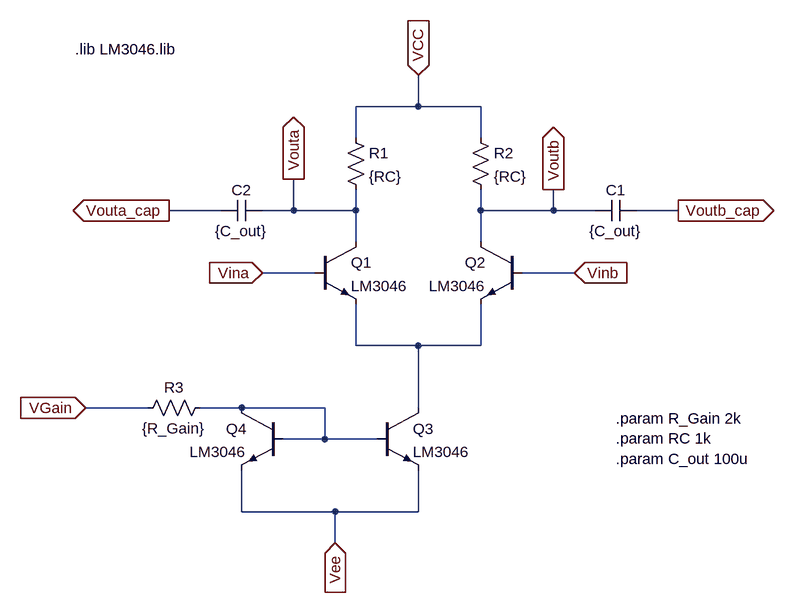
[diagram p0: schematic VariableGainAmplifier.asc]
VariableGainAmplifier.asc, the LTspice schematic file:
Version 4
SHEET 1 880 680
WIRE 192 -352 192 -400
WIRE 192 -352 96 -352
WIRE 288 -352 192 -352
WIRE 96 -304 96 -352
WIRE 288 -304 288 -352
WIRE -112 -192 -192 -192
WIRE 0 -192 0 -240
WIRE 0 -192 -48 -192
WIRE 96 -192 96 -224
WIRE 96 -192 0 -192
WIRE 288 -192 288 -224
WIRE 400 -192 400 -224
WIRE 400 -192 288 -192
WIRE 464 -192 400 -192
WIRE 592 -192 528 -192
WIRE 96 -144 96 -192
WIRE 288 -144 288 -192
WIRE 32 -96 -48 -96
WIRE 432 -96 352 -96
WIRE 96 16 96 -48
WIRE 192 16 96 16
WIRE 288 16 288 -48
WIRE 288 16 192 16
WIRE -224 112 -320 112
WIRE -80 112 -144 112
WIRE 48 112 -80 112
WIRE 192 112 192 16
WIRE 48 160 48 112
WIRE 48 160 -16 160
WIRE 128 160 48 160
WIRE -80 272 -80 208
WIRE 64 272 -80 272
WIRE 192 272 192 208
WIRE 192 272 64 272
WIRE 64 320 64 272
FLAG -48 -96 Vina
IOPIN -48 -96 In
FLAG 432 -96 Vinb
IOPIN 432 -96 In
FLAG 0 -240 Vouta
IOPIN 0 -240 Out
FLAG 400 -224 Voutb
IOPIN 400 -224 Out
FLAG 192 -400 VCC
IOPIN 192 -400 In
FLAG -320 112 VGain
IOPIN -320 112 In
FLAG 64 320 Vee
IOPIN 64 320 In
FLAG 592 -192 Voutb_cap
IOPIN 592 -192 Out
FLAG -192 -192 Vouta_cap
IOPIN -192 -192 Out
SYMBOL npn 32 -144 R0
SYMATTR InstName Q1
SYMATTR Value LM3046
SYMBOL npn 352 -144 M0
SYMATTR InstName Q2
SYMATTR Value LM3046
SYMBOL npn 128 112 R0
SYMATTR InstName Q3
SYMATTR Value LM3046
SYMBOL res 80 -320 R0
SYMATTR InstName R1
SYMATTR Value {RC}
SYMBOL res 272 -320 R0
SYMATTR InstName R2
SYMATTR Value {RC}
SYMBOL npn -16 112 M0
SYMATTR InstName Q4
SYMATTR Value LM3046
SYMBOL res -128 96 R90
WINDOW 0 0 56 VBottom 2
WINDOW 3 32 56 VTop 2
SYMATTR InstName R3
SYMATTR Value {R_Gain}
SYMBOL cap 528 -208 R90
WINDOW 0 0 32 VBottom 2
WINDOW 3 32 32 VTop 2
SYMATTR InstName C1
SYMATTR Value {C_out}
SYMBOL cap -48 -208 R90
WINDOW 0 0 32 VBottom 2
WINDOW 3 32 32 VTop 2
SYMATTR InstName C2
SYMATTR Value {C_out}
TEXT -336 -440 Left 2 !.lib LM3046.lib
TEXT 496 128 Left 2 !.param R_Gain 2k\n.param RC 1k\n.param C_out 100u

The netlist it stands for:
* VariableGainAmplifier.asc
Q1 Vouta Vina N001 0 LM3046
Q2 Voutb Vinb N001 0 LM3046
Q3 N001 N002 Vee 0 LM3046
R1 VCC Vouta {RC}
R2 VCC Voutb {RC}
Q4 N002 N002 Vee 0 LM3046
R3 N002 VGain {R_Gain}
C1 Voutb_cap Voutb {C_out}
C2 Vouta Vouta_cap {C_out}
.model NPN NPN
.model PNP PNP
.lib standard.bjt
.lib LM3046.lib
.param R_Gain 2k
.param RC 1k
.param C_out 100u
.backanno
.end